# EAGLE design pcb (EAGLE 9.5.2)
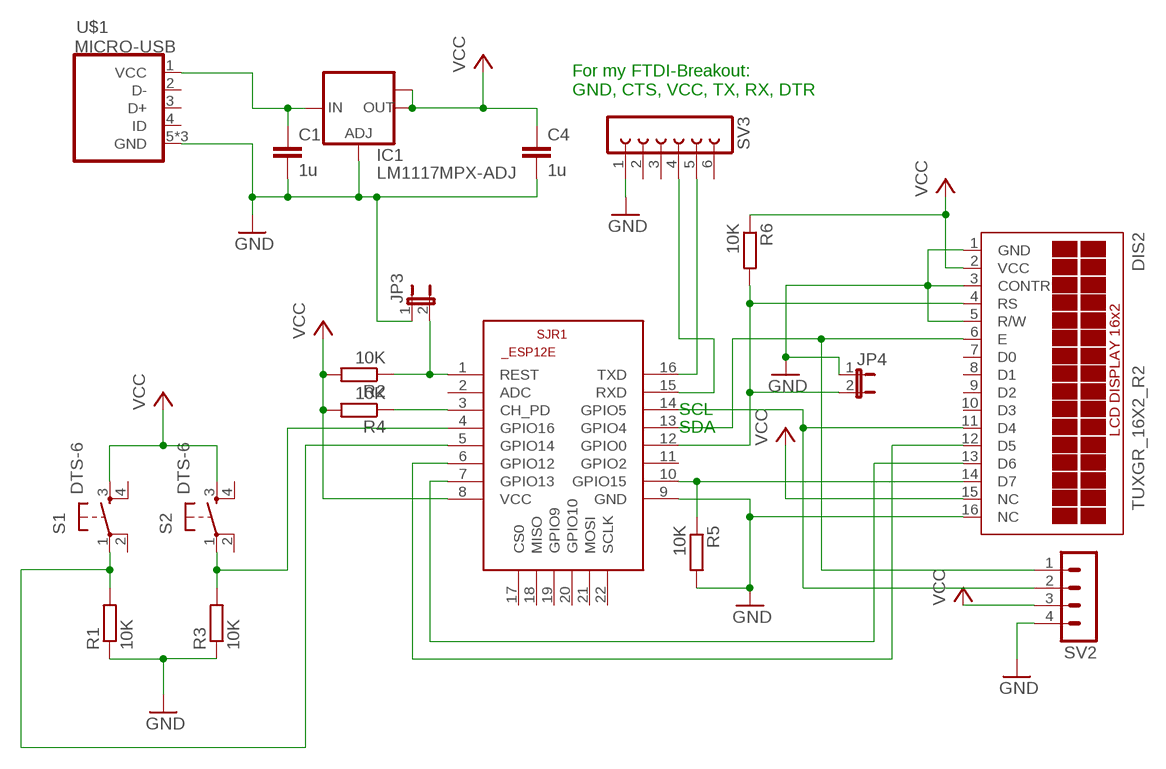
[diagram p0: schematic, sheet 1]

## Parts
C1  1u  C-EUC0805  [C0805]
C4  1u  C-EUC0805  [C0805]
DIS2  TUXGR_16X2_R2  [TUXGR_16X2_R2]
IC1  LM1117MPX-ADJ  [SOT223]
JP3  JP1E  [JP1]
JP4  JP1E  [JP1]
R1  10K  R-EU_R0805  [R0805]
R2  10K  R-EU_R0805  [R0805]
R3  10K  R-EU_R0805  [R0805]
R4  10K  R-EU_R0805  [R0805]
R5  10K  R-EU_R0805  [R0805]
R6  10K  R-EU_R0805  [R0805]
S1  DTS-6  [DTS-6]
S2  DTS-6  [DTS-6]
SJR1  ESP8266-12EESP12E  [ESP8266-ESP12E]
SV2  MA04-1  [MA04-1]
SV3  FE06-1  [FE06]
U$1  MICRO-USB  [MICRO-USB]

## Nets
GND: C1.2 C4.2 DIS2.1(GND) DIS2.3(CONTR) DIS2.5(R/W) DIS2.16(NC) IC1.1(ADJ) JP3.1 JP4.1 R1.1 R3.1 R5.2 SJR1.9(GND) SV2.4 SV3.1 U$1.5(GND) U$1.GND1(GND) U$1.GND2(GND)
N$1: DIS2.11(D4) SJR1.14(GPIO5) SV2.2
N$2: DIS2.12(D5) SJR1.6(GPIO12)
N$3: DIS2.13(D6) SJR1.7(GPIO13)
N$4: DIS2.14(D7) R5.1 SJR1.10(GPIO15)
N$5: DIS2.4(RS) JP4.2 R6.2 SJR1.12(GPIO0)
N$6: R3.2 S2.1 SJR1.4(GPIO16)
N$7: R1.2 S1.1 SJR1.5(GPIO14)
N$8: DIS2.6(E) SJR1.13(GPIO4) SV2.1
N$9: SJR1.15(RXD) SV3.4
N$10: SJR1.16(TXD) SV3.5
N$11: C1.1 IC1.3(IN) U$1.1(VCC)
N$12: JP3.2 R2.1 SJR1.1(REST)
N$13: R4.1 SJR1.3(CH_PD)
VCC: C4.1 DIS2.2(VCC) DIS2.15(NC) IC1.2(OUT) IC1.TAB(OUT1) R2.2 R4.2 R6.1 S1.3 S2.3 SJR1.8(VCC) SV2.3
Unconnected: DIS2.7(D0) DIS2.8(D1) DIS2.9(D2) DIS2.10(D3) S1.2 S1.4 S2.2 S2.4 SJR1.2(ADC) SJR1.11(GPIO2) SJR1.17(CS0) SJR1.18(MISO) SJR1.19(GPIO9) SJR1.20(GPIO10) SJR1.21(MOSI) SJR1.22(SCLK) SV3.2 SV3.3 SV3.6 U$1.2(D-) U$1.3(D+) U$1.4(ID)

## Notes on the sheet
- For my FTDI-Breakout:
  GND, CTS, VCC, TX, RX, DTR
- SCL
- SDA

## Library data of the parts
C1 C4 = rcl:C-EU: CAPACITOR, European symbol; SPICEPREFIX: C
DIS2 = display-lcd:TUXGR_16X2_R2: Tuxgraphics LCD display 16x2 characters reflective, without background light Source: tuxgr_12x2_r2.pdf; OC_FARNELL: unknown; OC_NEWARK: unknown
IC1 = lm1117:LM1117MPX-ADJ
JP3 JP4 = jumper:JP1E: JUMPER
R1-R6 = rcl:R-EU_: RESISTOR, European symbol; SPICEPREFIX: R
S1 S2 = switch-tact:DTS-6
SJR1 = esp12e:ESP8266-12E: ESP8266-12E Library for Eagle CAD The author not responsible for any damages or errors!. Created by Suhail jr.lt;/author>
SV2 = con-lstb:MA04-1: PIN HEADER; OC_FARNELL: unknown; OC_NEWARK: unknown
SV3 = con-lsta:FE06-1: FEMALE HEADER; OC_FARNELL: unknown; OC_NEWARK: unknown
U$1 = microusb:MICRO-USB: Micro USB B connector

## Board
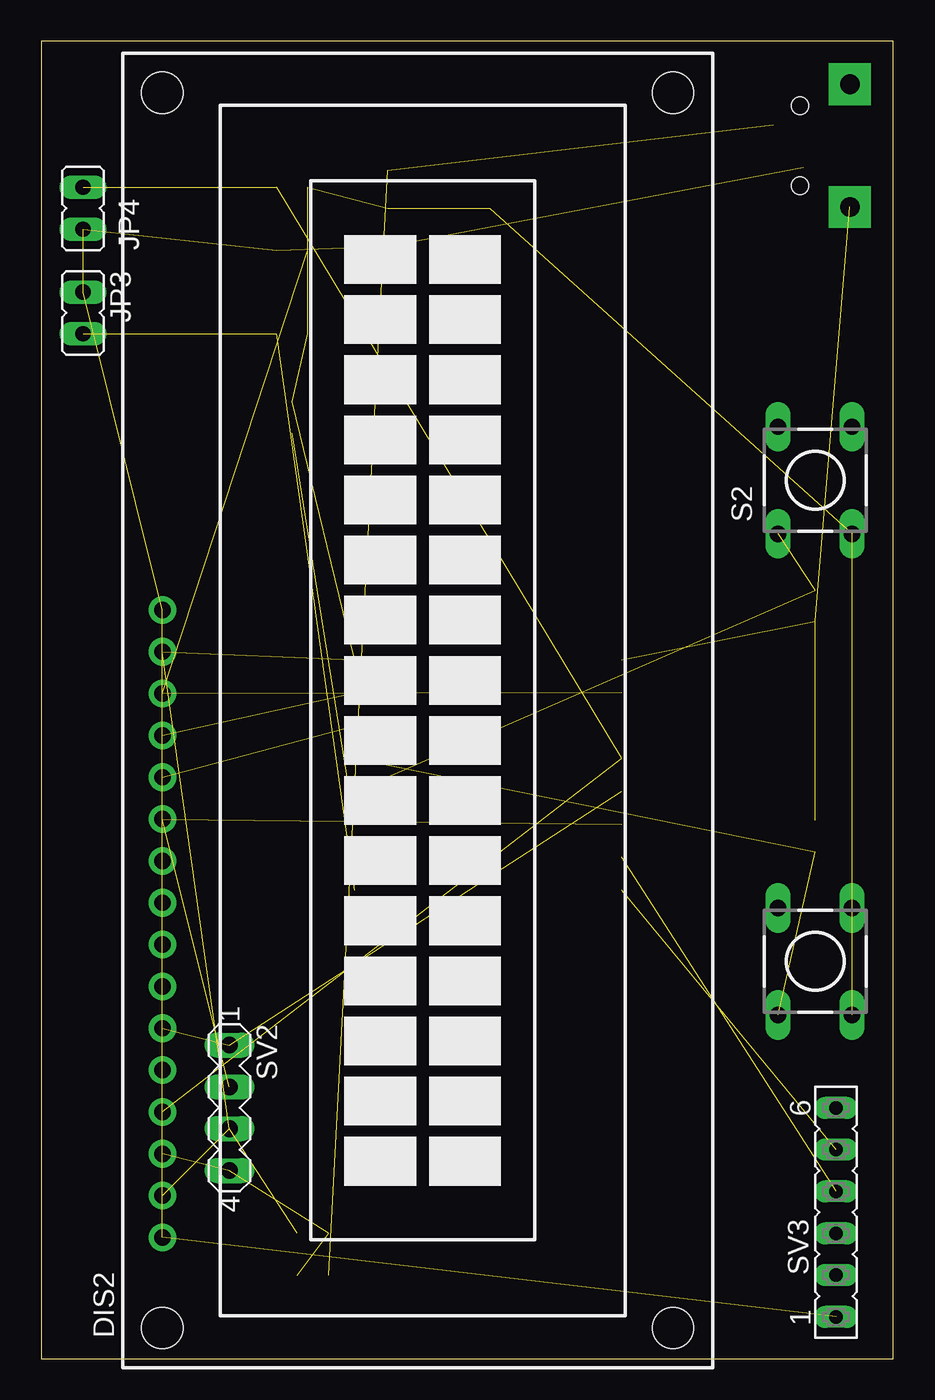
[diagram p1: board, top side]
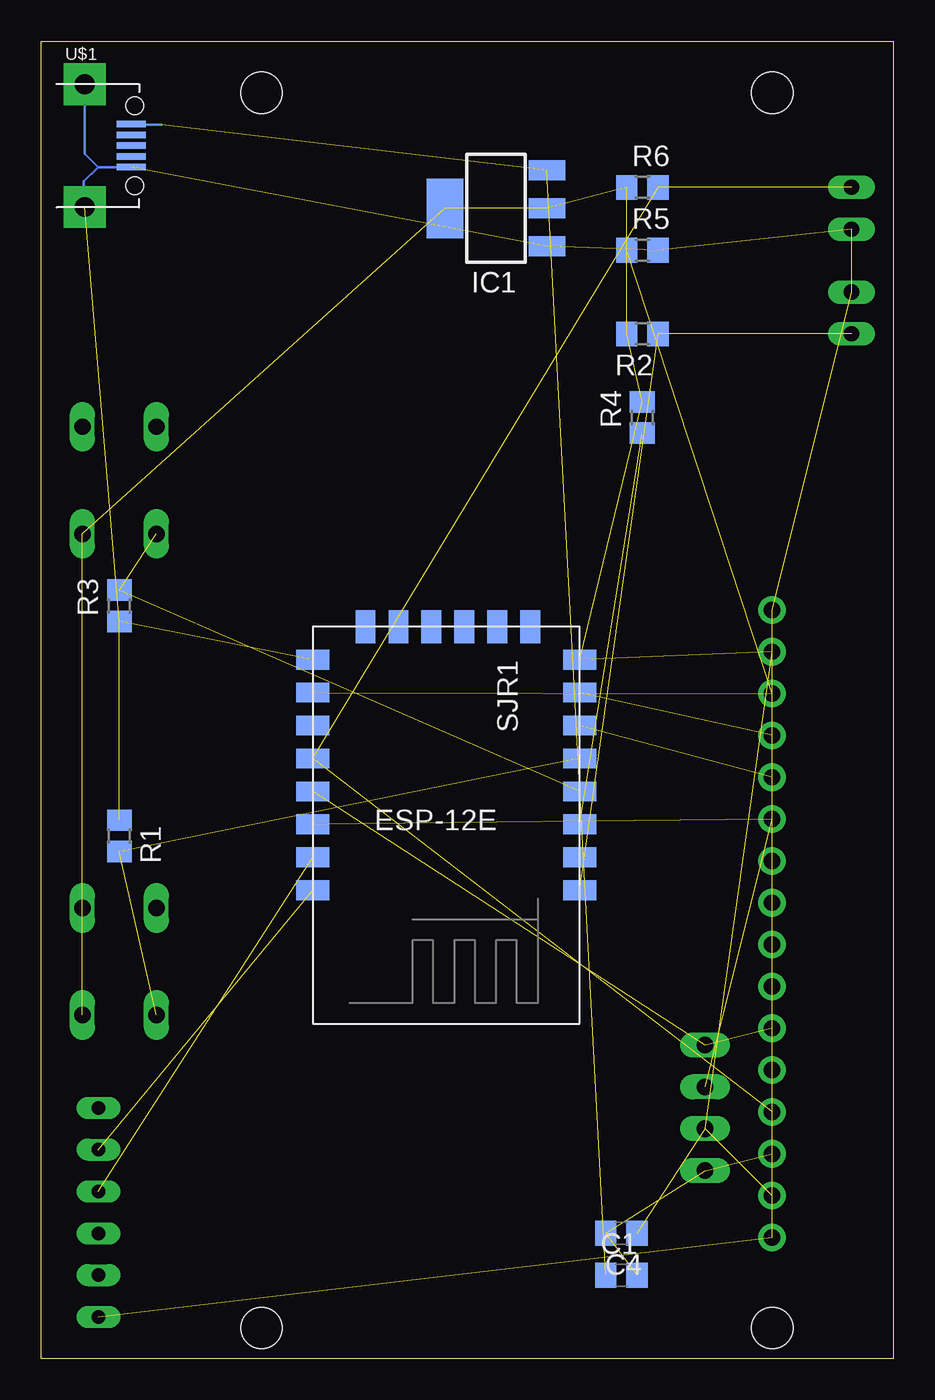
[diagram p2: board, bottom side, seen from below]

Size 51.74 x 80 mm. Coordinates in mm from the lower left corner, seen from the top.
Outline: 0,0 51.74,0 51.74,80 0,80 0,0
Copper layers (1*16): Top 0.035mm / dielectric 1.5mm / Bottom 0.035mm
Design rules "default": minimum track width 6mil, minimum drill 0.35mm, track to track 6mil, track to pad 6mil, pad to pad 6mil, via to via 6mil, smd to smd 6mil, copper to edge 40mil, drill to drill 6mil, minimum pad ring 10mil, minimum via ring 8mil, stop-mask expansion 4mil, vias tented up to drill 0mil, thermal gap 10mil

### Footprints (pad centres in the part's own frame; a part is rotated, then mirrored left to right if it is on the bottom)
C0805 = smd 1.3 x 1.5: 1 -0.95,0; 2 0.95,0
TUXGR_16X2_R2 = drill 1 pad 1.676: 1 -32,15.5; 2 -29.46,15.5; 3 -26.92,15.5; 4 -24.38,15.5; 5 -21.84,15.5; 6 -19.3,15.5; 7 -16.76,15.5; 8 -14.22,15.5; 9 -11.68,15.5; 10 -9.14,15.5; 11 -6.6,15.5; 12 -4.06,15.5; 13 -1.52,15.5; 14 1.02,15.5; 15 3.56,15.5; 16 6.1,15.5 | hole 2.5: -37.5,-15.5; 37.5,-15.5; -37.5,15.5; 37.5,15.5
SOT223 = smd 1.219 x 2.235: 1 -2.311,-3.099; 2 0,-3.099; 3 2.311,-3.099 | smd 3.6 x 2.2: TAB 0,3.099
JP1 = drill 0.914 long: 1 0,-1.27; 2 0,1.27
R0805 = smd 1.3 x 1.5: 1 -0.95,0; 2 0.95,0
DTS-6 = drill 1 long: 1 -3.25,2.25; 2 3.25,2.25; 3 -3.25,-2.25; 4 3.25,-2.25
ESP8266-ESP12E = smd 2 x 1.2: 1 -7.62,5.84; 2 -7.62,3.84; 3 -7.62,1.84; 4 -7.62,-0.16; 5 -7.62,-2.16; 6 -7.62,-4.16; 7 -7.62,-6.16; 8 -7.62,-8.16; 9 8.58,-8.16; 10 8.58,-6.16; 11 8.58,-4.16; 12 8.58,-2.16; 13 8.58,-0.16; 14 8.58,1.84; 15 8.58,3.84; 16 8.58,5.84 | smd 1.2 x 2: 17 -4.62,-10.16; 18 -2.62,-10.16; 19 -0.62,-10.16; 20 1.38,-10.16; 21 3.38,-10.16; 22 5.38,-10.16
MA04-1 = drill 1.016 long: 1 -3.81,0; 2 -1.27,0; 3 1.27,0; 4 3.81,0
FE06 = drill 0.813 long: 1 -6.35,0; 2 -3.81,0; 3 -1.27,0; 4 1.27,0; 5 3.81,0; 6 6.35,0
MICRO-USB = smd 0.4 x 1.75: 1 -1.3,4.525; 2 -0.65,4.525; 3 0,4.525; 4 0.65,4.525; 5 1.3,4.525 | drill 1.2 pad 2.54 square: GND1 -3.725,1.7; GND2 3.725,1.7 | hole 1.05: -2.425,4.73; 2.425,4.73

### Placement (x,y rotation side)
C1  16.51,5.08 0 bottom
C4  16.51,7.62 180 bottom
DIS2  22.86,39.37 90 top
IC1  24.13,69.85 90 bottom
JP3  2.54,63.5 180 top
JP4  2.54,69.85 0 top
R1  46.99,31.75 270 bottom
R2  15.24,62.23 180 bottom
R3  46.99,45.72 90 bottom
R4  15.24,57.15 90 bottom
R5  15.24,67.31 0 bottom
R6  15.24,71.12 0 bottom
S1  46.99,24.13 90 top
S2  46.99,53.34 90 top
SJR1  26.67,34.29 180 bottom
SV2  11.43,15.24 270 top
SV3  48.26,8.89 90 top
U$1  50.8,73.66 270 bottom

### Tracks (layer width: path | path; a pad name or v marks a point on that pad's centre or on a via)
GND  (15 unrouted)
  Bottom 0.152: U$1.5 48.29,72.36 | 48.29,72.36 49.15,71.5 49.15,69.98 U$1.GND2 | U$1.GND1 49.1,73.17 48.29,72.36
N$1  (2 unrouted)
N$2  (1 unrouted)
N$3  (1 unrouted)
N$4  (2 unrouted)
N$5  (3 unrouted)
N$6  (2 unrouted)
N$7  (2 unrouted)
N$8  (2 unrouted)
N$9  (1 unrouted)
N$10  (1 unrouted)
N$11  (2 unrouted)
  Bottom 0.152: U$1.1 46.24,74.93 44.45,74.93
N$12  (2 unrouted)
N$13  (1 unrouted)
VCC  (11 unrouted)